# EAGLE design node_focuser (EAGLE 7.5.0)
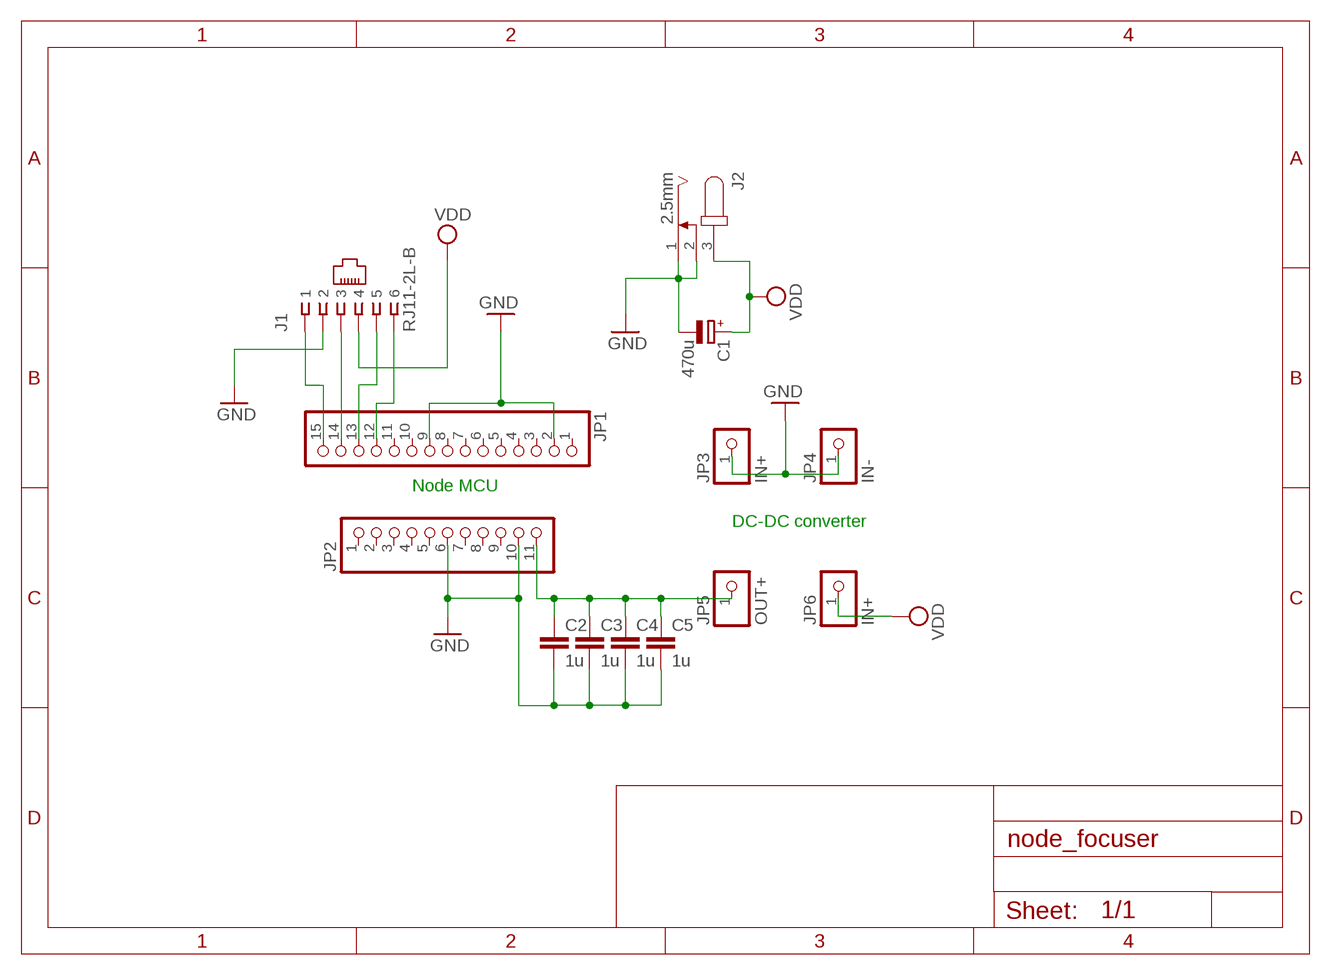
[diagram p0: schematic, sheet 1]

## Parts
C1  470u  CPOL-EUE3.5-8  [E3,5-8]
C2  1u  C5/3  [C5B3]
C3  1u  C5/3  [C5B3]
C4  1u  C5/3  [C5B3]
C5  1u  C5/3  [C5B3]
J1  RJ11-2L-B  [RJ11-NO_SHIELD]
J2  2.5mm  JACK-PLUG0  [SPC4077]
JP1  PINHD-1X15  [1X15]
JP2  PINHD-1X11  [1X11]
JP3  IN+  PINHD-1X1  [1X01]
JP4  IN-  PINHD-1X1  [1X01]
JP5  OUT+  PINHD-1X1  [1X01]
JP6  IN+  PINHD-1X1  [1X01]

## Nets
GND: C1.- C2.2 C3.2 C4.2 C5.2 J1.2 J2.1 J2.2 JP1.2 JP1.9 JP2.6 JP2.10 JP3.1 JP4.1
N$2: J1.1 JP1.15
N$3: J1.3 JP1.14
N$4: J1.5 JP1.13
N$5: J1.6 JP1.12
N$6: C2.1 C3.1 C4.1 C5.1 JP2.11 JP5.1
VDD: C1.+ J1.4 J2.3 JP6.1
Unconnected: JP1.1 JP1.3 JP1.4 JP1.5 JP1.6 JP1.7 JP1.8 JP1.10 JP1.11 JP2.1 JP2.2 JP2.3 JP2.4 JP2.5 JP2.7 JP2.8 JP2.9

## Notes on the sheet
- Node MCU
- DC-DC converter

## Library data of the parts
C1 = resistor:CPOL-EU: POLARIZED CAPACITOR, European symbol
C2-C5 = capacitor-wima:C: CAPACITOR naming: grid - package width
J1 = con-tycoelectronics:RJ11: CORCOM Modular RJ Jacks No Shield Source: www.tycoelectronics.com .. ENG_DS_1654001_1099_RJ_L_0507.pdf; MF: TYCO ELECTRONICS; MPN: RJ11-2L-B; OC_FARNELL: unknown; OC_NEWARK: 83F4463
J2 = con-jack:JACK-PLUG: DC POWER JACK Power Jack, DC, Right Angle, Through Hole, Rated 5A at 16VDC, PC Terminals Distributor: Farnell (www.Farnell.de) Drawing: 84N1161.pdf / 84N1162.pdf Manufacturer: SPC Technology (www.spctechnology.com) Type: SPC4077 / SPC 4078; OC_FARNELL: unknown; OC_NEWARK: unknown
JP1 = pinhead:PINHD-1X15: PIN HEADER
JP2 = pinhead:PINHD-1X11: PIN HEADER
JP3-JP6 = pinhead:PINHD-1X1: PIN HEADER

## Board
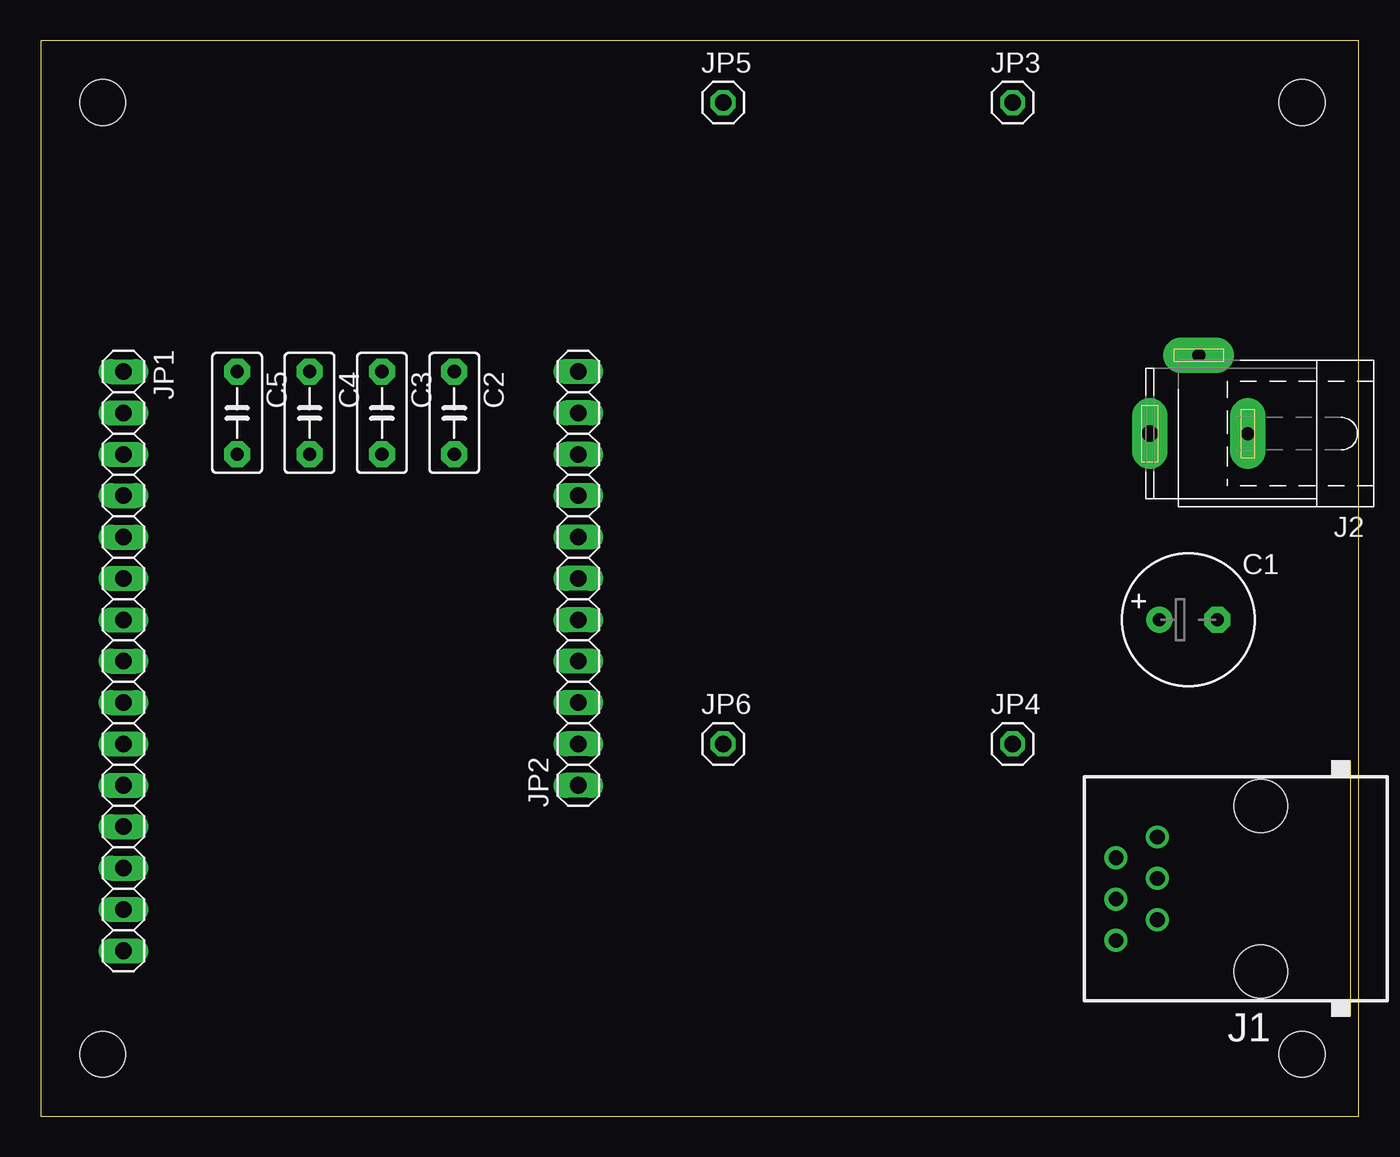
[diagram p1: board, top side]
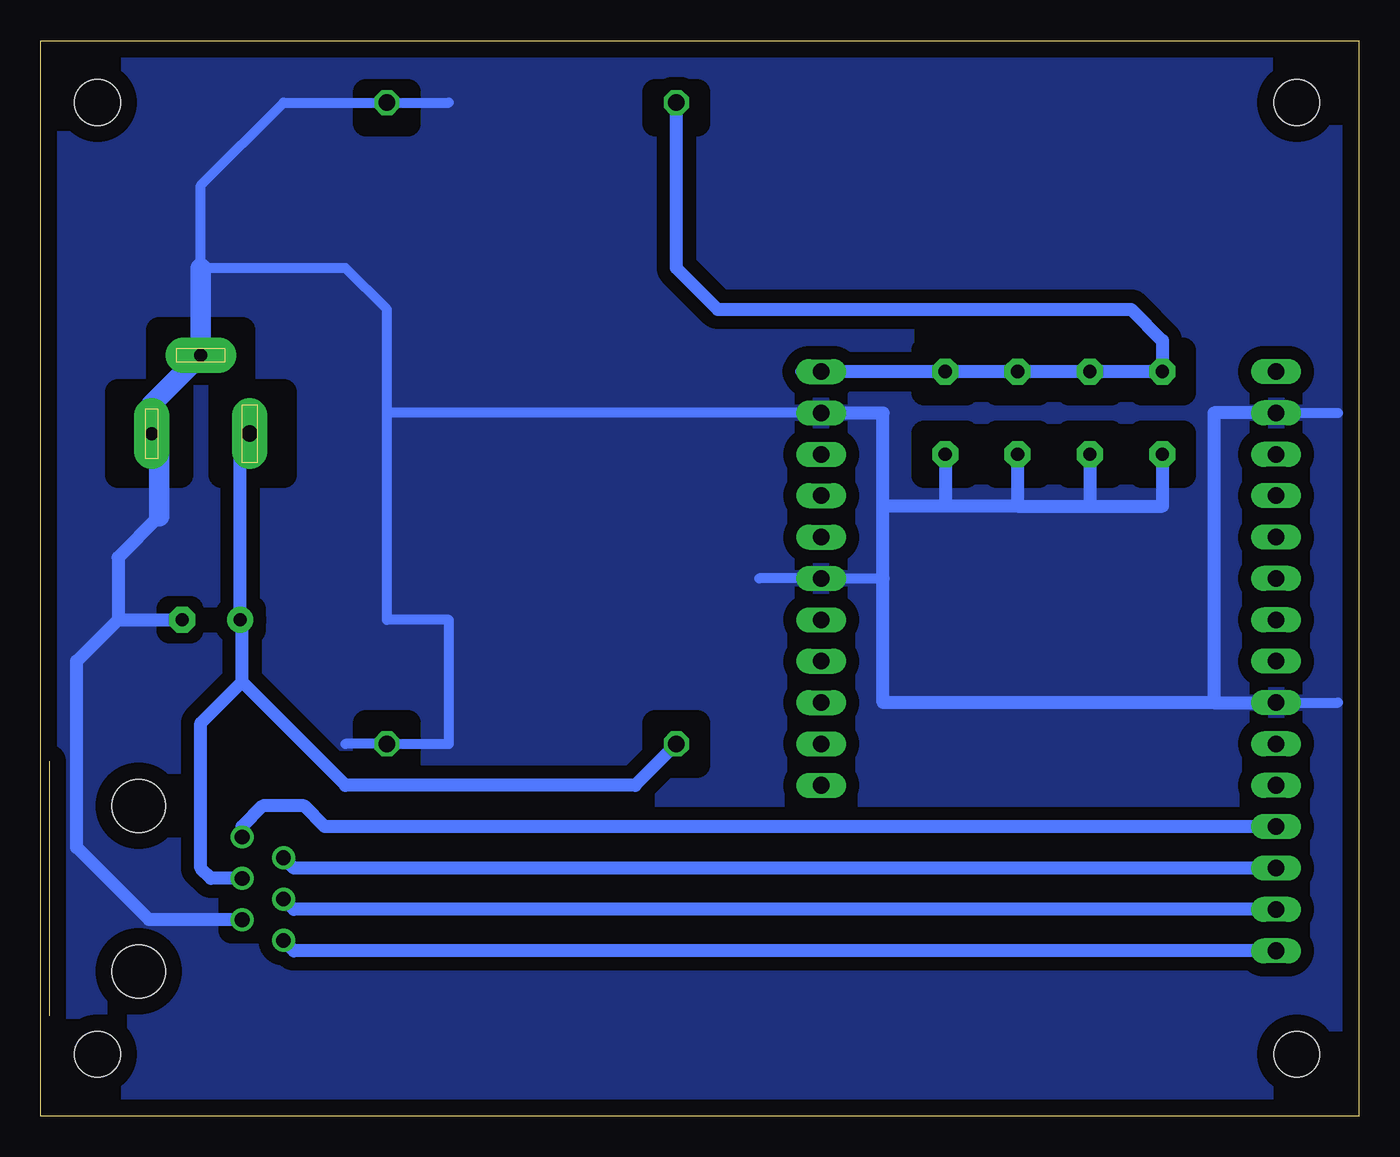
[diagram p2: board, bottom side, seen from below]

Size 80.95 x 66.03 mm. Coordinates in mm from the lower left corner, seen from the top.
Outline: 0,0 80.95,0 80.95,66.03 0,66.03 0,0
Copper layers (1*16): Top 0.035mm / dielectric 1.5mm / Bottom 0.035mm
Design rules "default": minimum track width 10mil, minimum drill 24mil, track to track 8mil, track to pad 8mil, pad to pad 8mil, via to via 8mil, smd to smd 8mil, copper to edge 40mil, drill to drill 8mil, minimum pad ring 10mil, minimum via ring 8mil, stop-mask expansion 4mil, vias tented up to drill 0mil, thermal gap 10mil
Holes 2.8 mm at 3.81,62.23 3.81,3.81 77.47,62.23 77.47,3.81
bRestrict: area 40.6,21.6 to 43.2,24.1; area 40.6,61 to 43.2,62.9; area 58.4,61 to 61,62.9; area 58.4,21.6 to 61,24.1; area 66,39.4 to 69.9,44.4; area 68.6,45.7 to 73.7,48.3; area 72.4,39.4 to 76.2,44.4; area 71.8,29.8 to 73,31.1; area 67.9,11.4 to 69.2,12.7; area 10.8,39.4 to 13.3,41.9; area 10.8,44.4 to 13.3,47; area 19.7,44.4 to 22.2,47; 6 more areas

### Footprints (pad centres in the part's own frame; a part is rotated, then mirrored left to right if it is on the bottom)
E3,5-8 = drill 0.813 pad 1.6: + -1.778,0 | drill 0.813 pad 1.6 octagon: - 1.778,0
C5B3 = drill 0.813 pad 1.6 octagon: 1 -2.54,0; 2 2.54,0
RJ11-NO_SHIELD = drill 0.9 pad 1.4: 1 -3.175,8.89; 2 -1.905,6.35; 3 -0.635,8.89; 4 0.635,6.35; 5 1.905,8.89; 6 3.175,6.35 | hole 3.251: -5.08,0; 5.08,0
SPC4077 = drill 0.8 pad 2.184 long: 1 -3,0; 2 0,-4.8 | drill 1 pad 2.184 long: 3 3,0
1X15 = drill 1.016 long: 1 -17.78,0; 2 -15.24,0; 3 -12.7,0; 4 -10.16,0; 5 -7.62,0; 6 -5.08,0; 7 -2.54,0; 8 0,0; 9 2.54,0; 10 5.08,0; 11 7.62,0; 12 10.16,0; 13 12.7,0; 14 15.24,0; 15 17.78,0
1X11 = drill 1.016 long: 1 -12.7,0; 2 -10.16,0; 3 -7.62,0; 4 -5.08,0; 5 -2.54,0; 6 0,0; 7 2.54,0; 8 5.08,0; 9 7.62,0; 10 10.16,0; 11 12.7,0
1X01 = drill 1.016 octagon: 1 0,0

### Placement (x,y rotation side)
C1  70.48,30.48 0 top
C2  25.4,43.18 270 top
C3  20.96,43.18 270 top
C4  16.51,43.18 270 top
C5  12.06,43.18 270 top
J1  74.93,13.97 90 top
J2  71.12,41.91 180 top
JP1  5.08,27.94 270 top
JP2  33.02,33.02 90 top
JP3  59.69,62.23 0 top
JP4  59.69,22.86 0 top
JP5  41.91,62.23 0 top
JP6  41.91,22.86 0 top

### Tracks (layer width: path | path; a pad name or v marks a point on that pad's centre or on a via)
GND
  Bottom 0.61: 73.66,41.45 J2.1 | JP1.9 1.27,25.4 | JP1.2 1.27,43.18 | 29.21,33.02 JP2.6 36.83,33.02 | JP2.10 59.69,43.18 | 59.69,43.18 59.69,49.53 62.23,52.07 71.12,52.07 71.12,57.15 66.04,62.23 JP3.1 55.88,62.23 | 62.23,22.86 JP4.1 55.88,22.86 55.88,30.48 59.69,30.48 59.69,43.18
  Bottom 0.813: J1.2 74.3,12.07 78.74,16.51 78.74,27.94 76.2,30.48 | JP2.10 29.21,43.18 29.21,37.46 | 29.21,37.46 29.21,33.02 29.21,25.4 8.89,25.4 | JP1.2 8.89,43.18 8.89,25.4 | 8.89,25.4 JP1.9 | C5.2 12.06,37.46 16.51,37.46 | C4.2 16.51,37.46 | C3.2 20.96,37.46 | C2.2 25.4,37.46 | 25.4,37.46 29.21,37.46 | 20.96,37.46 25.4,37.46 | 20.96,37.46 16.51,37.46 | 76.2,30.48 C1.- | 73.66,36.83 76.2,34.29 76.2,30.48
  Bottom 1.27: J2.1 74.12,43.71 J2.2 71.12,52.07 | 73.66,41.45 73.66,36.83
  pour Bottom (isolate 0.813): 81.28,1.27 1.27,1.27 1.27,64.77 81.28,64.77
N$2
  Bottom 0.813: JP1.15 65.41,10.16 J1.1
N$3
  Bottom 0.813: JP1.14 65.41,12.7 J1.3
N$4
  Bottom 0.813: JP1.13 65.41,15.24 J1.5
N$5
  Bottom 0.813: JP1.12 63.5,17.78 64.77,19.05 67.31,19.05 68.58,17.78 J1.6
N$6
  Bottom 0.61: JP2.11 34.29,45.72
  Bottom 0.813: JP5.1 41.91,52.07 39.37,49.53 13.97,49.53 12.06,47.62 C5.1 C4.1 C3.1 C2.1 JP2.11
VDD
  Bottom 0.813: J1.4 70.48,14.61 71.12,15.24 71.12,24.13 68.58,26.67 | 68.58,26.67 62.23,20.32 44.45,20.32 JP6.1 | 68.58,26.67 68.58,30.35 C1.+ 68.71,41.32 J2.3